# EAGLE design rc-driver (EAGLE 7.2.0)
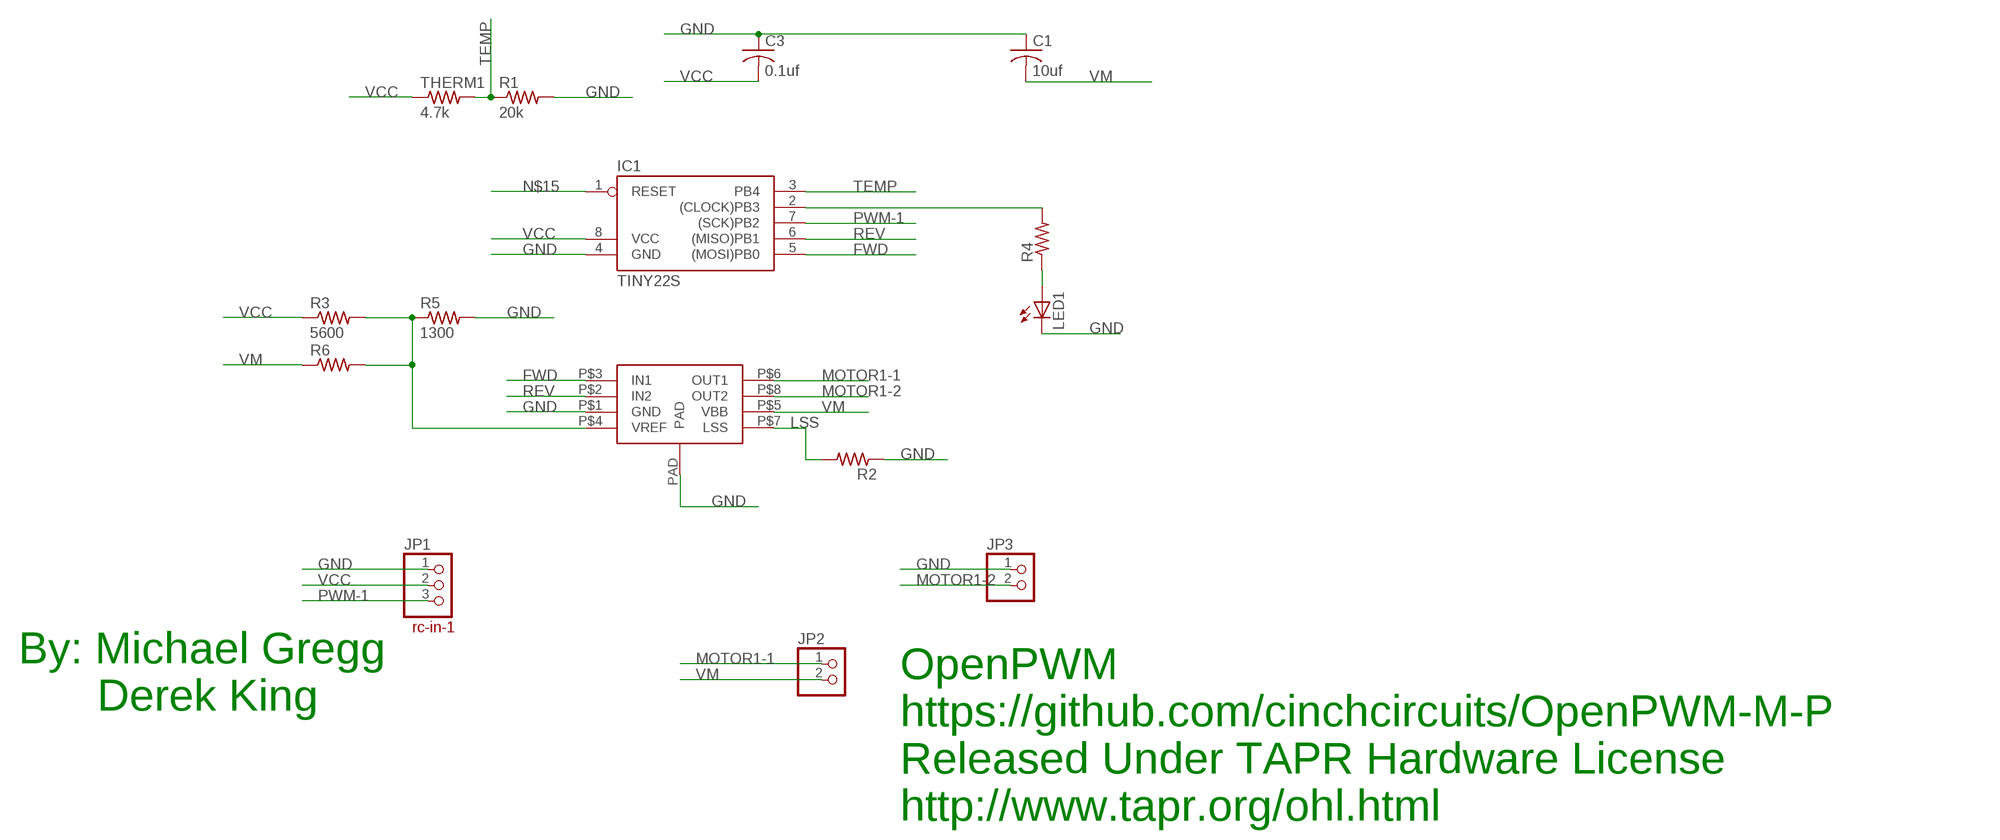
[diagram p0: schematic, sheet 1]

## Parts
C1  10uf  C-USC1210  [C1210]
C3  0.1uf  C-USC0805  [C0805]
IC1  TINY22S  [SOIC8]
JP1  PINHD-1X3  [1X03]
JP2  PINHD-1X2  [1X02]
JP3  PINHD-1X2  [1X02]
LED1  LEDCHIP-LED0603  [CHIP-LED0603]
R1  20k  R-US_R0603  [R0603]
R2  R-US_R0805W  [R0805W]
R3  5600  R-US_R0603  [R0603]
R4  R-US_R0603  [R0603]
R5  1300  R-US_R0603  [R0603]
R6  R-US_R0603  [R0603]
THERM1  4.7k  R-US_R0603  [R0603]
U$1  A4950-HBRIDGE  [SO-8EP]

## Nets
FWD: IC1.5((MOSI)PB0) U$1.P$3(IN1)
GND: C1.1 C3.1 IC1.4(GND) JP1.1 JP3.1 LED1.C R1.2 R2.1 R5.2 U$1.P$1(GND) U$1.PAD
LSS: R2.2 U$1.P$7(LSS)
MOTOR1-1: JP2.1 U$1.P$6(OUT1)
MOTOR1-2: JP3.2 U$1.P$8(OUT2)
N$1: R3.2 R5.1 R6.2 U$1.P$4(VREF)
N$2: IC1.2((CLOCK)PB3) R4.2
N$3: LED1.A R4.1
N$15: IC1.1(RESET)
PWM-1: IC1.7((SCK)PB2) JP1.3
REV: IC1.6((MISO)PB1) U$1.P$2(IN2)
TEMP: IC1.3(PB4) R1.1 THERM1.2
VCC: C3.2 IC1.8(VCC) JP1.2 R3.1 THERM1.1
VM: C1.2 JP2.2 R6.1 U$1.P$5(VBB)

## Notes on the sheet
- rc-in-1
- By: Michael Gregg
- OpenPWM
- Derek King
- https://github.com/cinchcircuits/OpenPWM-M-P
- Released Under TAPR Hardware License
- http://www.tapr.org/ohl.html

## Library data of the parts
C1 C3 = resistor:C-US: CAPACITOR, American symbol
IC1 = mgregg:TINY22: MICROCONTROLLER 1K ROM 128 bytes RAM 128 bytes EEPROM; OC_FARNELL: unknown; OC_NEWARK: unknown
JP1 = pinhead:PINHD-1X3: PIN HEADER
JP2 JP3 = pinhead:PINHD-1X2: PIN HEADER
LED1 = led:LED: LED OSRAM: - CHIPLED LG R971, LG N971, LY N971, LG Q971, LY Q971, LO R971, LY R971 LH N974, LH R974 LS Q976, LO Q976, LY Q976 LO Q996 - Hyper CHIPLED LW Q18S LB Q993, LB Q99A, LB R99A - SideLED LS A670, LO A670, LY A670, LG A670, LP A670 LB A673, LV A673, LT A673, LW A673 LH A674 LY A675 LS A676, LA A676, LO A676, LY A676, LW A676 LS A679, LY A679, LG A679 - Hyper Micro SIDELED® LS Y876, LA Y876, LO Y876, LY Y876 LT Y87S - SmartLED LW L88C, LW L88S LB L89C, LB L89S, LG L890 LS L89K, LO L89K, LY L89K LS L896, LA L896, LO L896, LY L896 - TOPLED LS T670, LO T670, LY T670, LG T670, LP T670 LSG T670, LSP T670, LSY T670, LOP T670, LYG T670 LG T671, LOG T671, LSG T671 LB T673, LV T673, LT T673, LW T673 LH T674 LS T676, LA T676, LO T676, LY T676, LB T676, LH T676, LSB T676, LW T676 LB T67C, LV T67C, LT T67C, LS T67K, LO T67K, LY T67K, LW E67C LS E67B, LA E67B, LO E67B, LY E67B, LB E67C, LV E67C, LT E67C LW T67C LS T679, LY T679, LG T679 LS T770, LO T770, LY T770, LG T770, LP T770 LB T773, LV T773, LT T773, LW T773 LH T774 LS E675, LA E675, LY E675, LS T675 LS T776, LA T776, LO T776, LY T776, LB T776 LHGB T686 LT T68C, LB T68C - Hyper Mini TOPLED® LB M676 - Mini TOPLED Santana® LG M470 LS M47K, LO M47K, LY M47K Source: http://www.osram.convergy.de LUXEON: - LUMILED® LXK2-PW12-R00, LXK2-PW12-S00, LXK2-PW14-U00, LXK2-PW14-V00 LXK2-PM12-R00, LXK2-PM12-S00, LXK2-PM14-U00 LXK2-PE12-Q00, LXK2-PE12-R00, LXK2-PE12-S00, LXK2-PE14-T00, LXK2-PE14-U00 LXK2-PB12-K00, LXK2-PB12-L00, LXK2-PB12-M00, LXK2-PB14-N00, LXK2-PB14-P00, LXK2-PB14-Q00 LXK2-PR12-L00, LXK2-PR12-M00, LXK2-PR14-Q00, LXK2-PR14-R00 LXK2-PD12-Q00, LXK2-PD12-R00, LXK2-PD12-S00 LXK2-PH12-R00, LXK2-PH12-S00 LXK2-PL12-P00, LXK2-PL12-Q00, LXK2-PL12-R00 Source: www.luxeon.com KINGBRIGHT: KA-3528ASYC Source: www.kingbright.com
R1-R6 THERM1 = resistor:R-US_: RESISTOR, American symbol
U$1 = mgregg:A4950-HBRIDGE

## Board
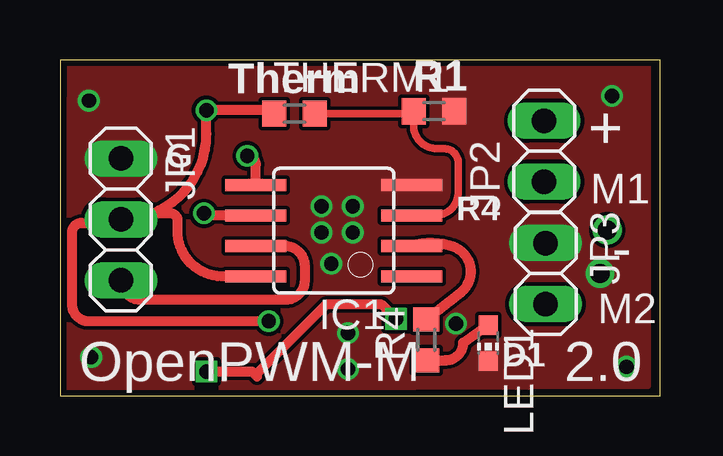
[diagram p1: board, top side]
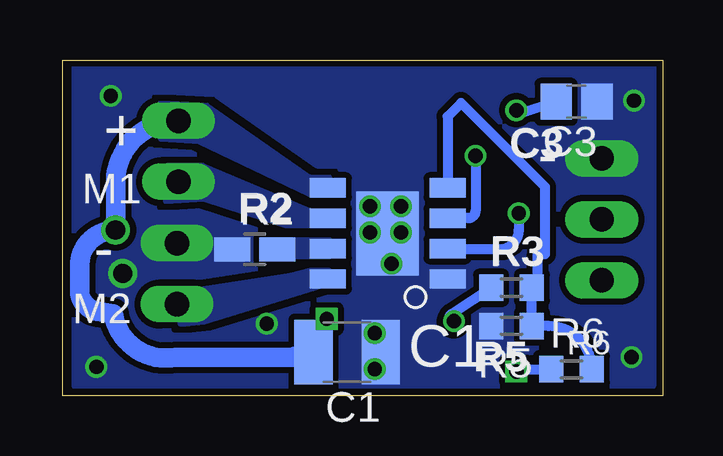
[diagram p2: board, bottom side, seen from below]

Size 25 x 14 mm. Coordinates in mm from the lower left corner, seen from the top.
Outline: 0,0 25,0 25,14 0,14 0,0
Copper layers (1*16): Top 0.035mm / dielectric 1.5mm / Bottom 0.035mm
Design rules "SeeedStudio_2layer_DRU_no_angle_20140221": minimum track width 6mil, minimum drill 12mil, track to track 6mil, track to pad 6mil, pad to pad 6mil, via to via 6mil, smd to smd 0mil, copper to edge 10mil, drill to drill 10mil, minimum pad ring 10mil, minimum via ring 6mil, stop-mask expansion 2mil, vias tented up to drill 100mil, thermal gap 10mil

### Footprints (pad centres in the part's own frame; a part is rotated, then mirrored left to right if it is on the bottom)
C1210 = smd 1.6 x 2.7: 1 -1.4,0; 2 1.4,0
C0805 = smd 1.3 x 1.5: 1 -0.85,0; 2 0.85,0
SOIC8 = smd 0.5 x 2.54: 1 -1.905,-3.251; 2 -0.645,-3.251; 3 0.625,-3.251; 4 1.895,-3.251; 5 1.905,3.251; 6 0.635,3.251; 7 -0.635,3.251; 8 -1.905,3.251
1X03 = drill 1.016 long: 1 -2.54,0; 2 0,0; 3 2.54,0
1X02 = drill 1.016 long: 1 -1.27,0; 2 1.27,0
CHIP-LED0603 = smd 0.8 x 0.8: A 0,-0.75; C 0,0.75
R0603 = smd 1 x 1.1: 1 -0.85,0; 2 0.85,0
R0805W = smd 1.5 x 1: 1 -0.94,0; 2 0.94,0
SO-8EP = smd 0.802 x 1.505: P$1 -2.04,-2.54; P$2 -0.77,-2.54; P$3 0.5,-2.54; P$4 1.77,-2.54; P$5 1.77,2.455; P$6 0.5,2.455; P$7 -0.77,2.455; P$8 -2.04,2.455 | smd 3.5 x 2.6: PAD -0.14,-0.04

### Placement (x,y rotation side)
C1  13.15,1.81 180 bottom
C3  3.59,12.26 180 bottom
IC1  11.41,6.88 90 top
JP1  2.54,7.35 270 top
JP2  20.17,10.19 90 top
JP3  20.23,5.09 270 top
LED1  17.84,2.19 180 top
R1  15.58,11.86 0 top
R2  17,6.1 0 bottom
R3  6.3,4.5 0 bottom
R4  15.26,2.32 90 top
R5  6.3,2.9 180 bottom
R6  3.8,1.1 0 bottom
THERM1  9.77,11.76 0 top
U$1  11.5,6.9 90 bottom

### Tracks (layer width: path | path; a pad name or v marks a point on that pad's centre or on a via)
FWD  (via drill 0.6)
  Top 0.406: IC1.5 8.16,9.64 arc90 v7.8,10
  Bottom 0.406: v7.8,10 7.8,7.7 arc90 8.1,7.4 U$1.P$3
GND  (via drill 0.6, 0.8)
  other vias: 1.3,1.6 23.6,1.2 12.2,6.8 11.3,5.5 12.2,7.9 10.9,6.8 10.9,7.9 22.5,5.1 12,2.6 12,1.1 16.5,3 1.2,12.3 23,12.5
  pour Top (rank 6, no thermals): 24.5,13.8 0.4,13.8 0.3,0.3 24.5,0.4
  pour Bottom (isolate 0.254, rank 6, no thermals): 24.5,0.4 24.5,13.8 0.4,13.8 0.4,0.4
LSS
  pour Bottom (no thermals): 13.9,5.8 15.9,5.8 15.9,6.5 13.9,6.5
MOTOR1-1
  pour Bottom (no thermals): 19.2,9.6 14.7,7.7 14.1,7.7 14.1,7.1 15.7,7.1 19.1,8.2 20.7,8.1 20.6,9.6
MOTOR1-2
  pour Bottom (no thermals): 13.9,5.2 14.7,5.2 15.5,5 19.3,4.4 20.1,4.4 20.1,3 19.1,3.1 13.9,4.7
N$1
  Bottom 0.406: U$1.P$4 8.96,11.64 8.4,12.2 4.9,8.7 4.9,5.9 5.2,5.9 5.2,4.8 R3.2 R5.1 4.75,2.9 arc90 R6.2
N$2
  Top 0.406: 14.7,6.2 IC1.2 arc-38 16.4,6.2 arc-122 16.7,4.3 R4.2
N$3
  Top 0.406: R4.1 16.07,1.47 arc90 16.8,2.2 LED1.A
PWM-1
  Top 0.406: IC1.7 9.36,6.25 arc-90 10.2,5.4 10.2,4.8 arc-90 9.4,4 3.35,4 arc-90 JP1.3
REV  (via drill 0.6)
  Top 0.406: IC1.6 6.08,7.51 arc-90 v6,7.6
  Bottom 0.406: v6,7.6 6,6.9 arc90 6.8,6.1 8.93,6.1 arc90 U$1.P$2
TEMP
  Top 0.305: IC1.3 15.61,7.5 arc90 16.6,8.5 16.6,9.7 arc90 16,10.3 15.7,10.3 arc-90 14.73,11.27 R1.1 arc-90 14.63,11.76 THERM1.2
VCC  (via drill 0.6)
  Top 0.406: THERM1.1 arc90 8.68,11.9 v6.1,11.9 6.1,10.91 arc-90 JP1.2 | IC1.8 6.72,4.97 arc-90 4.9,6.9 4.9,7.3 arc90 4.6,7.6 2.79,7.6 arc90 JP1.2 | v8.7,3.1 1.2,3.1 arc-90 0.5,3.8 0.5,6.8 arc-90 0.9,7.2 2.39,7.2 arc90 JP1.2
  Bottom 0.406: v6.1,11.9 arc90 5.96,11.76 C3.2 | R3.1 8.8,3.4 arc-166 v8.7,3.1
VM  (via drill 0.6, 0.8)
  Top 0.406: v14,3.2 13.4,3.8 11.1,3.8 8.2,0.9 8.2,0.8 8,1 v6.1,1
  Bottom 0.254: C1.2 15.4,1.91 15.4,1.6
  Bottom 0.406: C1.2 14,1.81 v14,3.2 | v6.1,1 6,1.1 R6.1
  Bottom 0.813: 15.4,1.6 20.3,1.6 arc90 22.9,3.4 23.4,3.5 arc90 24.3,4.4 24.3,5.4 arc90 v22.8,6.9 22.8,8.93 arc90 JP2.2
  pour Bottom (no thermals): 13.9,8.4 14.7,8.4 19.3,10.6 20.9,10.7 20.9,12.2 19,12.1 14.7,9.1 13.9,9.1

### Text on the board
tPlace: Therm | R1 | G | + | M1 | R4 | - | M2 | OpenPWM-M | D1 | 2.0
bPlace: C3 | + | - | M1 | R2 | R3 | - | M2 | R6 | R5 | C1